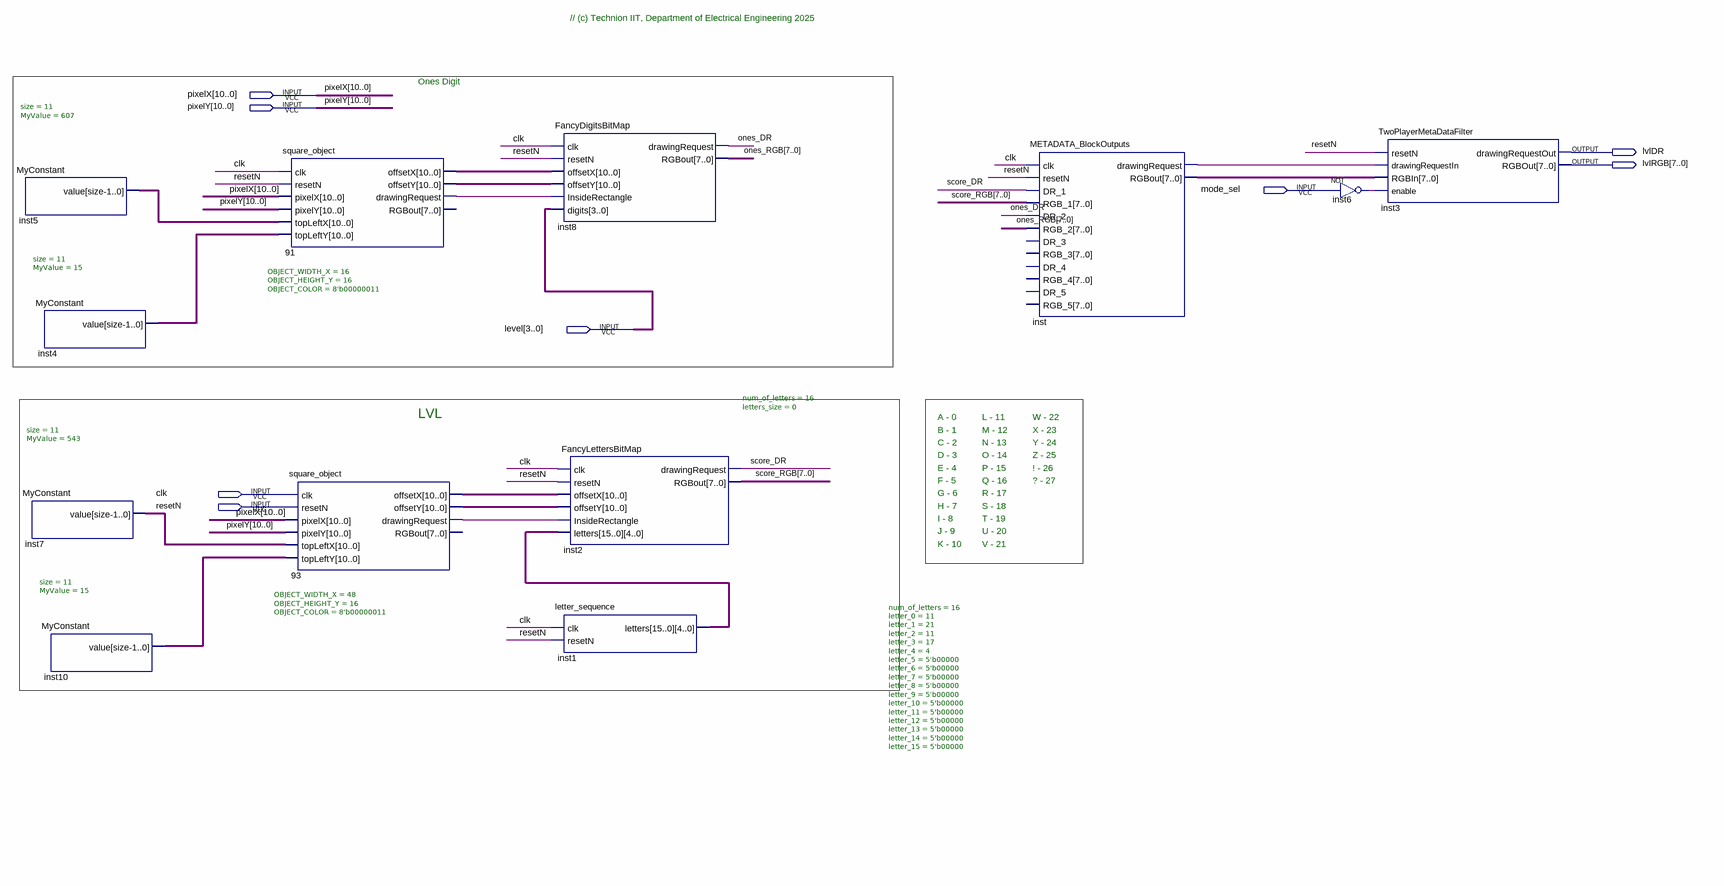
[diagram p0: schematic sheet]
// Quartus schematic Lvl_Block.bdf as structural Verilog: 12 symbols, 8 pins
module Lvl_Block (
  input  [10:0] pixelX,
  input  [10:0] pixelY,
  input  mode_sel,
  input  [3:0] level,
  input  clk,
  input  resetN,
  output lvlDR,
  output [7:0] lvlRGB
);

  wire inst6_out, inst_drawingrequest, n91_drawingrequest, n93_drawingrequest, ones_DR, score_DR;
  wire [7:0] inst_rgbout, ones_RGB, score_RGB;
  wire [10:0] inst4_value, inst5_value, inst7_value, inst10_value, n91_offsetx, n91_offsety, n93_offsetx,
       n93_offsety;
  wire [79:0] inst1_letters;

  MyConstant #(.size(11), .MyValue(607)) inst5 (.value(inst5_value));
  MyConstant #(.size(11), .MyValue(543)) inst7 (.value(inst7_value));
  MyConstant #(.size(11), .MyValue(15)) inst4 (.value(inst4_value));
  MyConstant #(.size(11), .MyValue(15)) inst10 (.value(inst10_value));
  square_object #(.OBJECT_WIDTH_X(16), .OBJECT_HEIGHT_Y(16), .OBJECT_COLOR(8'b00000011)) u_91 (
    .clk(clk), .resetN(resetN), .pixelX(pixelX), .pixelY(pixelY), .topLeftX(inst5_value),
    .topLeftY(inst4_value), .offsetX(n91_offsetx), .offsetY(n91_offsety), .drawingRequest(n91_drawingrequest));  // open: RGBout
  square_object #(.OBJECT_WIDTH_X(48), .OBJECT_HEIGHT_Y(16), .OBJECT_COLOR(8'b00000011)) u_93 (
    .clk(clk), .resetN(resetN), .pixelX(pixelX), .pixelY(pixelY), .topLeftX(inst7_value),
    .topLeftY(inst10_value), .offsetX(n93_offsetx), .offsetY(n93_offsety), .drawingRequest(n93_drawingrequest));  // open: RGBout
  FancyDigitsBitMap inst8 (
    .clk(clk), .resetN(resetN), .offsetX(n91_offsetx), .offsetY(n91_offsety),
    .InsideRectangle(n91_drawingrequest), .digits(level), .drawingRequest(ones_DR), .RGBout(ones_RGB));
  FancyLettersBitMap #(.num_of_letters(16), .letters_size(0)) inst2 (
    .clk(clk), .resetN(resetN), .offsetX(n93_offsetx), .offsetY(n93_offsety),
    .InsideRectangle(n93_drawingrequest), .letters(inst1_letters), .drawingRequest(score_DR),
    .RGBout(score_RGB));
  letter_sequence #(.num_of_letters(16), .letter_0(11), .letter_1(21), .letter_2(11), .letter_3(17), .letter_4(4), .letter_5(5'b00000), .letter_6(5'b00000), .letter_7(5'b00000), .letter_8(5'b00000), .letter_9(5'b00000), .letter_10(5'b00000), .letter_11(5'b00000), .letter_12(5'b00000), .letter_13(5'b00000), .letter_14(5'b00000), .letter_15(5'b00000)) inst1 (
    .clk(clk), .resetN(resetN), .letters(inst1_letters));
  METADATA_BlockOutputs inst (
    .clk(clk), .resetN(resetN), .DR_1(score_DR), .RGB_1(score_RGB), .DR_2(ones_DR), .RGB_2(ones_RGB),
    .drawingRequest(inst_drawingrequest), .RGBout(inst_rgbout));  // open: DR_3, RGB_3, DR_4, RGB_4, DR_5, RGB_5
  not inst6 (inst6_out, mode_sel);
  TwoPlayerMetaDataFilter inst3 (
    .resetN(resetN), .drawingRequestIn(inst_drawingrequest), .RGBIn(inst_rgbout), .enable(inst6_out),
    .drawingRequestOut(lvlDR), .RGBOut(lvlRGB));

  // Notes on the sheet:
  //   // (c) Technion IIT, Department of Electrical Engineering 2025
  //   Ones Digit 
  //   LVL
  //   A - 0
  //   L - 11
  //   W - 22
  //   B - 1
  //   M - 12
  //   X - 23
  //   C - 2
  //   N - 13
  //   Y - 24
  //   D - 3
  //   O - 14
  //   Z - 25
  //   E - 4
  //   P - 15
  //   ! - 26
  //   F - 5
  //   Q - 16
  //   ? - 27
  //   G - 6
  //   R - 17
  //   H - 7
  //   S - 18
  //   I - 8
  //   T - 19
  //   J - 9
  //   U - 20
  //   K - 10
  //   V - 21
endmodule
